# Altium project BRR_CB_P03_REV_A1_1-STM32MP157.PrjPcb (part 1 of 3)
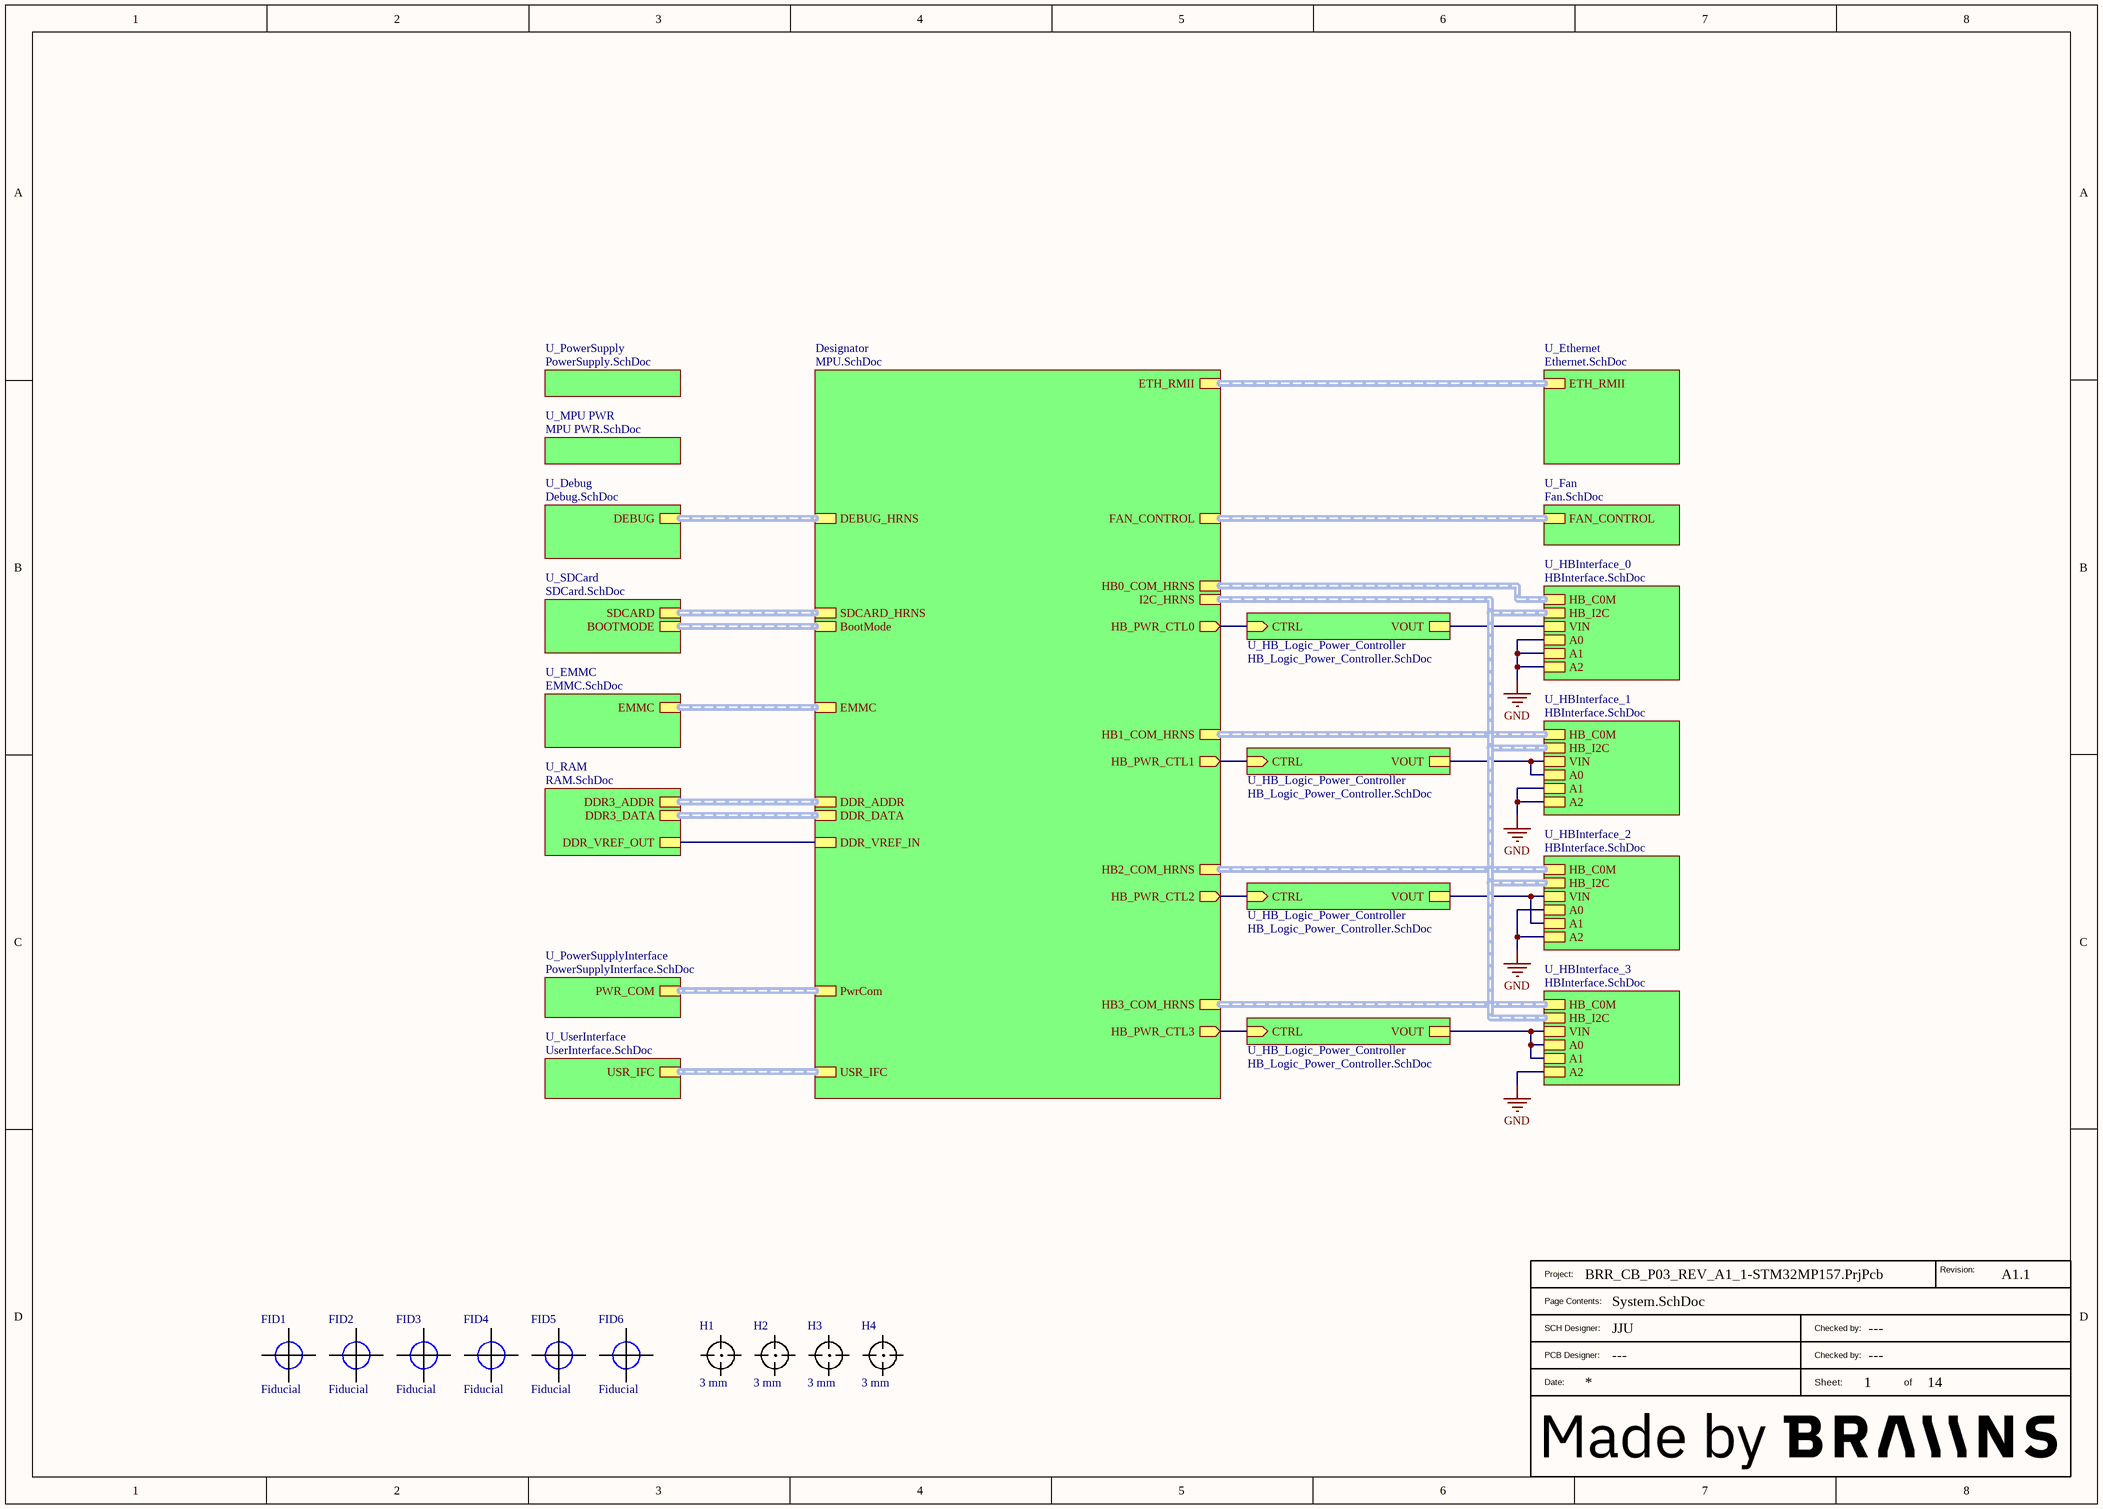
[diagram p0: System.SchDoc]
PcbDesigner: ---; PcbReviewer: ---; Revision: A1.1; SchDesigner: JJU; SchReviewer: ---
14 sheets, 311 parts. Net scope: hierarchical (ports join the sheet entries above them; power ports are global).
Board file: BRR_CB_P03_REV_A1_1-STM32MP157.PcbDoc
Sheets:
  System.SchDoc
    Designator = MPU.SchDoc
    U_Ethernet = Ethernet.SchDoc
    U_Fan = Fan.SchDoc
    U_PowerSupply = PowerSupply.SchDoc
    U_SDCard = SDCard.SchDoc
    U_EMMC = EMMC.SchDoc
    U_RAM = RAM.SchDoc
    U_HBInterface_0 = HBInterface.SchDoc
    U_HBInterface_1 = HBInterface.SchDoc
    U_HBInterface_2 = HBInterface.SchDoc
    U_HBInterface_3 = HBInterface.SchDoc
    U_Debug = Debug.SchDoc
    U_UserInterface = UserInterface.SchDoc
    U_PowerSupplyInterface = PowerSupplyInterface.SchDoc
    U_MPU PWR = MPU PWR.SchDoc
    U_HB_Logic_Power_Controller = HB_Logic_Power_Controller.SchDoc
    U_HB_Logic_Power_Controller = HB_Logic_Power_Controller.SchDoc
    U_HB_Logic_Power_Controller = HB_Logic_Power_Controller.SchDoc
    U_HB_Logic_Power_Controller = HB_Logic_Power_Controller.SchDoc

## Sheet System.SchDoc
size A3; SheetNumber: 1; SheetTotal: 14

### Parts
(Parts that share a designator on the sheet are numbered #1, #2 ... from top to bottom, then left to right.)
?#1  BraiinsTitleBlockWithLogo  (value not drawn)  (graphical)
FID1  Fiducial  [FID_1MM]
FID2  Fiducial  [FID_1MM]
FID3  Fiducial  [FID_1MM]
FID4  Fiducial  [FID_1MM]
FID5  Fiducial  [FID_1MM]
FID6  Fiducial  [FID_1MM]
H1  3 mm  [THT_HOLE_NONPLATE_3_0]
H2  3 mm  [THT_HOLE_NONPLATE_3_0]
H3  3 mm  [THT_HOLE_NONPLATE_3_0]
H4  3 mm  [THT_HOLE_NONPLATE_3_0]

### Sub-sheets
Designator = MPU.SchDoc: DDR_ADDR (harness DDR_ADDR), DEBUG_HRNS (harness DEBUG_HRNS), DDR_DATA (harness DDR_DATA), DDR_VREF_IN, SDCARD_HRNS (harness SDCARD_HRNS), EMMC (harness EMMC), ETH_RMII (harness ETH_RMII), HB2_COM_HRNS (harness HB_COM_HRNS), HB3_COM_HRNS (harness HB_COM_HRNS), HB0_COM_HRNS (harness HB_COM_HRNS), HB1_COM_HRNS (harness HB_COM_HRNS), PwrCom (harness PwrCom), I2C_HRNS (harness I2C_HRNS), FAN_CONTROL (harness FAN_CONTROL), BootMode (harness BootMode), USR_IFC (harness USR_IFC), HB_PWR_CTL2 (out), HB_PWR_CTL1 (out), HB_PWR_CTL3 (out), HB_PWR_CTL0 (out)
U_Debug = Debug.SchDoc: DEBUG (harness DEBUG_HRNS)
U_EMMC = EMMC.SchDoc: EMMC (harness EMMC)
U_Ethernet = Ethernet.SchDoc: ETH_RMII (harness ETH_RMII)
U_Fan = Fan.SchDoc: FAN_CONTROL (harness FAN_CONTROL)
U_HB_Logic_Power_Controller = HB_Logic_Power_Controller.SchDoc: VOUT, CTRL (in)
U_HB_Logic_Power_Controller = HB_Logic_Power_Controller.SchDoc: VOUT, CTRL (in)
U_HB_Logic_Power_Controller = HB_Logic_Power_Controller.SchDoc: VOUT, CTRL (in)
U_HB_Logic_Power_Controller = HB_Logic_Power_Controller.SchDoc: VOUT, CTRL (in)
U_HBInterface_0 = HBInterface.SchDoc: HB_C0M (harness HB_COM_HRNS), HB_I2C (harness I2C_HRNS), A0, A1, A2, VIN
U_HBInterface_1 = HBInterface.SchDoc: HB_C0M (harness HB_COM_HRNS), HB_I2C (harness I2C_HRNS), A0, A1, A2, VIN
U_HBInterface_2 = HBInterface.SchDoc: HB_C0M (harness HB_COM_HRNS), HB_I2C (harness I2C_HRNS), A0, A1, A2, VIN
U_HBInterface_3 = HBInterface.SchDoc: HB_C0M (harness HB_COM_HRNS), HB_I2C (harness I2C_HRNS), A0, A1, A2, VIN
U_MPU PWR = MPU PWR.SchDoc: no entries
U_PowerSupply = PowerSupply.SchDoc: no entries
U_PowerSupplyInterface = PowerSupplyInterface.SchDoc: PWR_COM (harness PwrCom)
U_RAM = RAM.SchDoc: DDR3_ADDR (harness DDR_ADDR), DDR3_DATA (harness DDR_DATA), DDR_VREF_OUT
U_SDCard = SDCard.SchDoc: SDCARD (harness SDCARD_HRNS), BOOTMODE (harness BootMode)
U_UserInterface = UserInterface.SchDoc: USR_IFC (harness USR_IFC)

### Nets
DDR_VREF: sheet Designator/DDR_VREF_IN, sheet U_RAM/DDR_VREF_OUT
GND: sheet U_HBInterface_0/A0, sheet U_HBInterface_0/A1, sheet U_HBInterface_0/A2, sheet U_HBInterface_1/A1, sheet U_HBInterface_1/A2, sheet U_HBInterface_2/A0, sheet U_HBInterface_2/A2, sheet U_HBInterface_3/A2
3V3_PROTECTED: sheet U_HBInterface_0/VIN, sheet U_HB_Logic_Power_Controller/VOUT
3V3_PROTECTED: sheet U_HBInterface_1/A0, sheet U_HBInterface_1/VIN, sheet U_HB_Logic_Power_Controller/VOUT  [a separate net that carries the same name]
3V3_PROTECTED: sheet U_HBInterface_2/A1, sheet U_HBInterface_2/VIN, sheet U_HB_Logic_Power_Controller/VOUT  [a separate net that carries the same name]
3V3_PROTECTED: sheet U_HBInterface_3/A0, sheet U_HBInterface_3/A1, sheet U_HBInterface_3/VIN, sheet U_HB_Logic_Power_Controller/VOUT  [a separate net that carries the same name]
HB_PWR_CTL0: sheet Designator/HB_PWR_CTL0, sheet U_HB_Logic_Power_Controller/CTRL
HB_PWR_CTL1: sheet Designator/HB_PWR_CTL1, sheet U_HB_Logic_Power_Controller/CTRL
HB_PWR_CTL2: sheet Designator/HB_PWR_CTL2, sheet U_HB_Logic_Power_Controller/CTRL
HB_PWR_CTL3: sheet Designator/HB_PWR_CTL3, sheet U_HB_Logic_Power_Controller/CTRL

### Buses and harness runs
harness sheet Designator/BootMode = sheet U_SDCard/BOOTMODE
harness sheet Designator/DDR_ADDR = sheet U_RAM/DDR3_ADDR
harness sheet Designator/DDR_DATA = sheet U_RAM/DDR3_DATA
harness sheet Designator/DEBUG_HRNS = sheet U_Debug/DEBUG
harness sheet Designator/EMMC = sheet U_EMMC/EMMC
harness sheet Designator/ETH_RMII = sheet U_Ethernet/ETH_RMII
harness sheet Designator/FAN_CONTROL = sheet U_Fan/FAN_CONTROL
harness sheet Designator/HB0_COM_HRNS = sheet U_HBInterface_0/HB_C0M
harness sheet Designator/HB1_COM_HRNS = sheet U_HBInterface_1/HB_C0M
harness sheet Designator/HB2_COM_HRNS = sheet U_HBInterface_2/HB_C0M
harness sheet Designator/HB3_COM_HRNS = sheet U_HBInterface_3/HB_C0M
harness sheet Designator/I2C_HRNS = sheet U_HBInterface_0/HB_I2C = sheet U_HBInterface_1/HB_I2C = sheet U_HBInterface_2/HB_I2C = sheet U_HBInterface_3/HB_I2C
harness sheet Designator/PwrCom = sheet U_PowerSupplyInterface/PWR_COM
harness sheet Designator/SDCARD_HRNS = sheet U_SDCard/SDCARD
harness sheet Designator/USR_IFC = sheet U_UserInterface/USR_IFC

### Notes on the sheet
- (in symbol BraiinsTitleBlockWithLogo) Revision:; Project:; Page Contents:; SCH Designer:; Checked by:; PCB Designer:; Date:; Sheet:; of

### Library data of the parts
FID1-FID6 = 30186: Fiducial 1mm; Part_Type: Other; Part_Status: New; ID: 30186; Updated By: janjuranek; Manufacturer Part Description: Fiducial 1mm; Created By: janjuranek; Created_Date: 2023-05-23 18:24:59; Updated_Date: 2023-05-23 18:25:39; ComponentLink1Description: Datasheet; ComponentLink2Description: Supplier Part Details
H1-H4 = 30117: Mechanical hole, non plated; Part_Status: New; ID: 30117; Updated By: janjuranek; Value: 3 mm; Part_Type: Mechanical; Manufacturer Part Description: Mechanical hole, non plated; Created By: janjuranek; Created_Date: 2023-03-17 21:20:29; Updated_Date: 2023-03-17 21:20:49; ComponentLink1Description: Datasheet; ComponentLink2Description: Supplier Part Details

## Sheet MPU.SchDoc
size A3; SheetNumber: 8; SheetTotal: 14
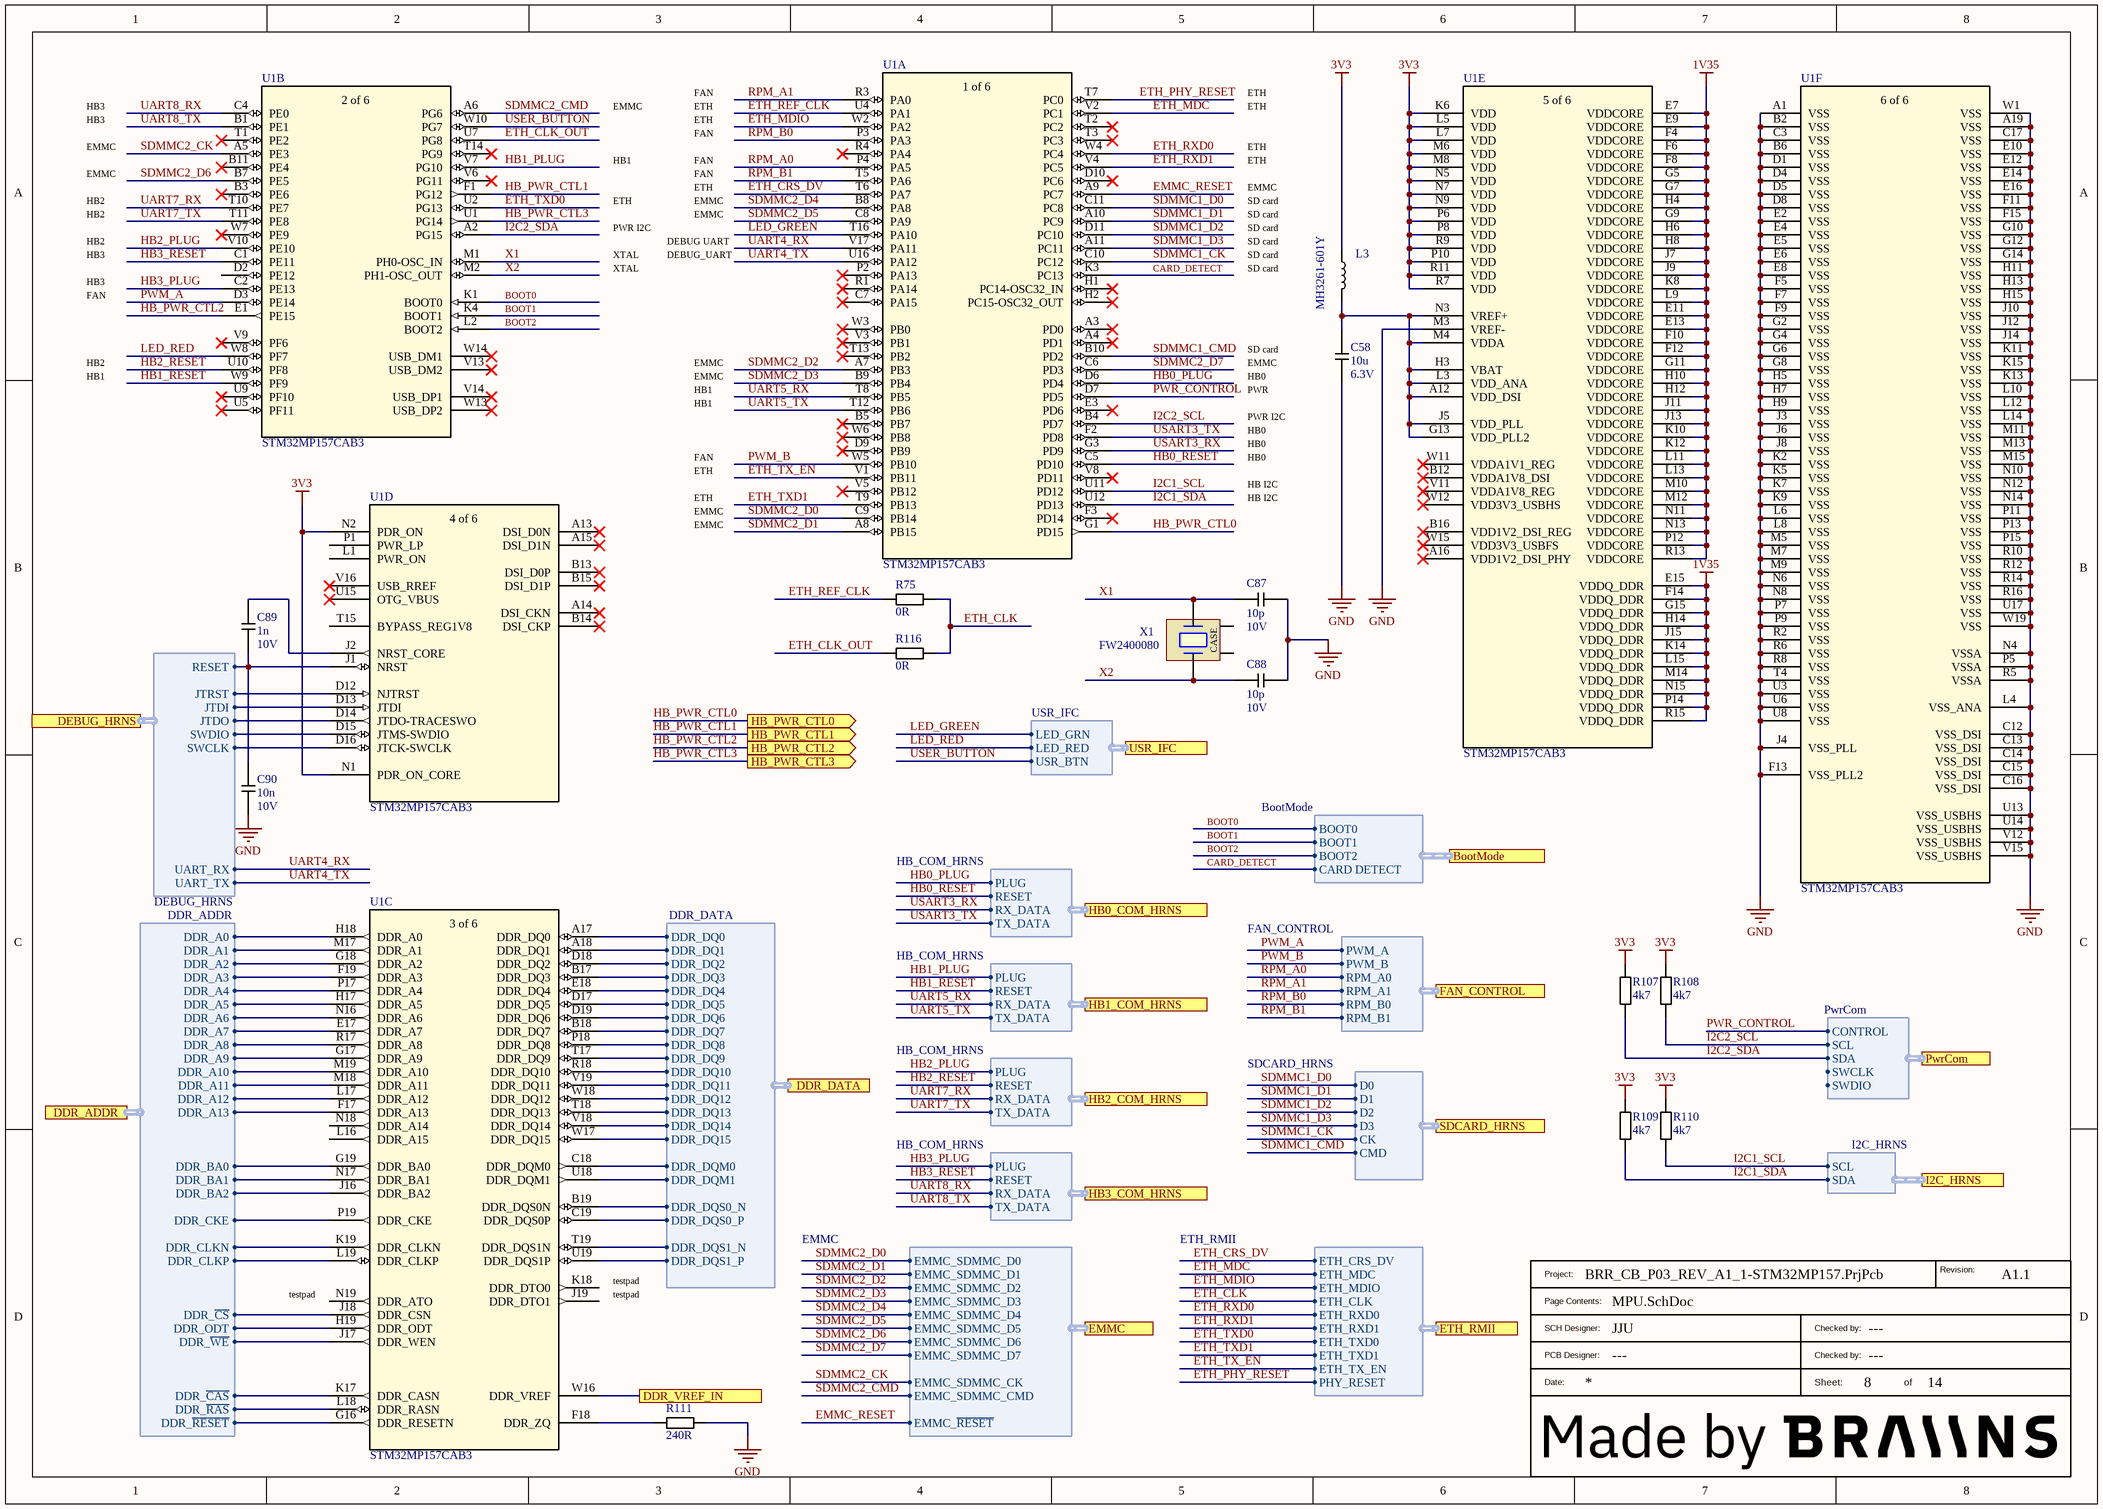
[diagram p1: MPU.SchDoc]

### Parts
(Parts that share a designator on the sheet are numbered #1, #2 ... from top to bottom, then left to right.)
?#2  BraiinsTitleBlockWithLogo  (value not drawn)  (graphical)
C58  Voltage_Rating: 6.3V  [CAP0603]  (hidden comment: 10u)
C87  Voltage_Rating: 10V  [CAP0402]  (hidden comment: 10p)
C88  Voltage_Rating: 10V  [CAP0402]  (hidden comment: 10p)
C89  Voltage_Rating: 10V  [CAP0402]  (hidden comment: 1n)
C90  Voltage_Rating: 10V  [CAP0402]  (hidden comment: 10n)
L3  MH3261-601Y  [RES1206]
R75  0R  [RES0402]
R107  4k7  [RES0402]
R108  4k7  [RES0402]
R109  4k7  [RES0402]
R110  4k7  [RES0402]
R111  240R  [RES0402]
R116  0R  [RES0402]
U1  STM32MP157CAB3  [LFBGA354_16X16]  (parts A,B,C,D,E,F of 6)
X1  FW2400080  [XTAL_4PIN_20X16]

### Ports
BootMode (harness BootMode), DDR_ADDR (harness DDR_ADDR), DDR_DATA (harness DDR_DATA), DDR_VREF_IN, DEBUG_HRNS (harness DEBUG_HRNS), EMMC (harness EMMC), ETH_RMII (harness ETH_RMII), FAN_CONTROL (harness FAN_CONTROL), HB0_COM_HRNS (harness HB_COM_HRNS), HB1_COM_HRNS (harness HB_COM_HRNS), HB2_COM_HRNS (harness HB_COM_HRNS), HB3_COM_HRNS (harness HB_COM_HRNS), HB_PWR_CTL0 (out), HB_PWR_CTL1 (out), HB_PWR_CTL2 (out), HB_PWR_CTL3 (out), I2C_HRNS (harness I2C_HRNS), PwrCom (harness PwrCom), SDCARD_HRNS (harness SDCARD_HRNS), USR_IFC (harness USR_IFC)

### Harnesses
DDR_DATA: DDR_DQ0, DDR_DQ1, DDR_DQ10, DDR_DQ11, DDR_DQ12, DDR_DQ13, DDR_DQ14, DDR_DQ15, DDR_DQ2, DDR_DQ3, DDR_DQ4, DDR_DQ5, DDR_DQ6, DDR_DQ7, DDR_DQ8, DDR_DQ9, DDR_DQM0, DDR_DQM1, DDR_DQS0_N, DDR_DQS0_P, DDR_DQS1_N, DDR_DQS1_P
DDR_ADDR: DDR_A0, DDR_A1, DDR_A10, DDR_A11, DDR_A12, DDR_A13, DDR_A2, DDR_A3, DDR_A4, DDR_A5, DDR_A6, DDR_A7, DDR_A8, DDR_A9, DDR_BA0, DDR_BA1, DDR_BA2, DDR_CKE, DDR_CLKN, DDR_CLKP, DDR_~{CAS}, DDR_~{CS}, DDR_ODT, DDR_~{RAS}, DDR_~{RESET}, DDR_~{WE}
DEBUG_HRNS: JTDI, JTDO, JTRST, RESET, SWCLK, SWDIO, UART_TX, UART_RX
SDCARD_HRNS: CK, CMD, D0, D1, D2, D3
EMMC: EMMC_~{RESET}, EMMC_SDMMC_CK, EMMC_SDMMC_CMD, EMMC_SDMMC_D0, EMMC_SDMMC_D1, EMMC_SDMMC_D2, EMMC_SDMMC_D3, EMMC_SDMMC_D4, EMMC_SDMMC_D5, EMMC_SDMMC_D6, EMMC_SDMMC_D7
ETH_RMII: ETH_CRS_DV, ETH_MDC, ETH_MDIO, ETH_CLK, ETH_RXD0, ETH_RXD1, ETH_TXD0, ETH_TXD1, ETH_TX_EN, PHY_RESET
HB_COM_HRNS: PLUG, RESET, RX_DATA, TX_DATA
I2C_HRNS: SCL, SDA
PwrCom: CONTROL, SCL, SDA, SWCLK, SWDIO
FAN_CONTROL: PWM_A, PWM_B, RPM_A0, RPM_A1, RPM_B0, RPM_B1
BootMode: BOOT0, BOOT1, BOOT2, CARD DETECT
USR_IFC: LED_GRN, LED_RED, USR_BTN

### Nets
1V35: U1.E7(VDDCORE) U1.E9(VDDCORE) U1.E11(VDDCORE) U1.E13(VDDCORE) U1.E15(VDDQ_DDR) U1.F4(VDDCORE) U1.F6(VDDCORE) U1.F8(VDDCORE) U1.F10(VDDCORE) U1.F12(VDDCORE) U1.F14(VDDQ_DDR) U1.G5(VDDCORE) U1.G7(VDDCORE) U1.G9(VDDCORE) U1.G11(VDDCORE) U1.G15(VDDQ_DDR) U1.H4(VDDCORE) U1.H6(VDDCORE) U1.H8(VDDCORE) U1.H10(VDDCORE) U1.H12(VDDCORE) U1.H14(VDDQ_DDR) U1.J7(VDDCORE) U1.J9(VDDCORE) U1.J11(VDDCORE) U1.J13(VDDCORE) U1.J15(VDDQ_DDR) U1.K8(VDDCORE) U1.K10(VDDCORE) U1.K12(VDDCORE) U1.K14(VDDQ_DDR) U1.L9(VDDCORE) U1.L11(VDDCORE) U1.L13(VDDCORE) U1.L15(VDDQ_DDR) U1.M10(VDDCORE) U1.M12(VDDCORE) U1.M14(VDDQ_DDR) U1.N11(VDDCORE) U1.N13(VDDCORE) U1.N15(VDDQ_DDR) U1.P12(VDDCORE) U1.P14(VDDQ_DDR) U1.R13(VDDCORE) U1.R15(VDDQ_DDR)
3V3: L3.1 R107.1 R108.1 R109.1 R110.1 U1.K6(VDD) U1.L5(VDD) U1.L7(VDD) U1.M6(VDD) U1.M8(VDD) U1.N1(PDR_ON_CORE) U1.N2(PDR_ON) U1.N5(VDD) U1.N7(VDD) U1.N9(VDD) U1.P6(VDD) U1.P8(VDD) U1.P10(VDD) U1.R7(VDD) U1.R9(VDD) U1.R11(VDD)
DDR_VREF: U1.W16(DDR_VREF) ; port DDR_VREF_IN
GND: C58.2 C87.1 C88.2 C90.2 R111.2 U1.A1(VSS) U1.A19(VSS) U1.B2(VSS) U1.B6(VSS) U1.C3(VSS) U1.C12(VSS_DSI) U1.C13(VSS_DSI) U1.C14(VSS_DSI) U1.C15(VSS_DSI) U1.C16(VSS_DSI) U1.C17(VSS) U1.D1(VSS) U1.D4(VSS) U1.D5(VSS) U1.D8(VSS) U1.E2(VSS) U1.E4(VSS) U1.E5(VSS) U1.E6(VSS) U1.E8(VSS) U1.E10(VSS) U1.E12(VSS) U1.E14(VSS) U1.E16(VSS) U1.F5(VSS) U1.F7(VSS) U1.F9(VSS) U1.F11(VSS) U1.F13(VSS_PLL2) U1.F15(VSS) U1.G2(VSS) U1.G4(VSS) U1.G6(VSS) U1.G8(VSS) U1.G10(VSS) U1.G12(VSS) U1.G14(VSS) U1.H5(VSS) U1.H7(VSS) U1.H9(VSS) U1.H11(VSS) U1.H13(VSS) U1.H15(VSS) U1.J3(VSS) U1.J4(VSS_PLL) U1.J6(VSS) U1.J8(VSS) U1.J10(VSS) U1.J12(VSS) U1.J14(VSS) U1.K2(VSS) U1.K5(VSS) U1.K7(VSS) U1.K9(VSS) U1.K11(VSS) U1.K13(VSS) U1.K15(VSS) U1.L4(VSS_ANA) U1.L6(VSS) U1.L8(VSS) U1.L10(VSS) U1.L12(VSS) U1.L14(VSS) U1.M3(VREF-) U1.M5(VSS) U1.M7(VSS) U1.M9(VSS) U1.M11(VSS) U1.M13(VSS) U1.M15(VSS) U1.N4(VSSA) U1.N6(VSS) U1.N8(VSS) U1.N10(VSS) U1.N12(VSS) U1.N14(VSS) U1.P5(VSSA) U1.P7(VSS) U1.P9(VSS) U1.P11(VSS) U1.P13(VSS) U1.P15(VSS) U1.R2(VSS) U1.R5(VSSA) U1.R6(VSS) U1.R8(VSS) U1.R10(VSS) U1.R12(VSS) U1.R14(VSS) U1.R16(VSS) U1.T4(VSS) U1.U3(VSS) U1.U6(VSS) U1.U8(VSS) U1.U13(VSS_USBHS) U1.U14(VSS_USBHS) U1.U17(VSS) U1.V12(VSS_USBHS) U1.V15(VSS_USBHS) U1.W1(VSS) U1.W19(VSS)
BOOT0: U1.K1(BOOT0) ; port BootMode.BOOT0
BOOT1: U1.K4(BOOT1) ; port BootMode.BOOT1
BOOT2: U1.L2(BOOT2) ; port BootMode.BOOT2
CARD_DETECT: U1.K3(PC13) ; port BootMode.CARD DETECT
DDR3_A0: U1.H18(DDR_A0) ; port DDR_ADDR.DDR_A0
DDR3_A1: U1.M17(DDR_A1) ; port DDR_ADDR.DDR_A1
DDR3_A2: U1.G18(DDR_A2) ; port DDR_ADDR.DDR_A2
DDR3_A3: U1.F19(DDR_A3) ; port DDR_ADDR.DDR_A3
DDR3_A4: U1.P17(DDR_A4) ; port DDR_ADDR.DDR_A4
DDR3_A5: U1.H17(DDR_A5) ; port DDR_ADDR.DDR_A5
DDR3_A6: U1.N16(DDR_A6) ; port DDR_ADDR.DDR_A6
DDR3_A7: U1.E17(DDR_A7) ; port DDR_ADDR.DDR_A7
DDR3_A8: U1.R17(DDR_A8) ; port DDR_ADDR.DDR_A8
DDR3_A9: U1.G17(DDR_A9) ; port DDR_ADDR.DDR_A9
DDR3_A10: U1.M19(DDR_A10) ; port DDR_ADDR.DDR_A10
DDR3_A11: U1.M18(DDR_A11) ; port DDR_ADDR.DDR_A11
DDR3_A12: U1.L17(DDR_A12) ; port DDR_ADDR.DDR_A12
DDR3_A13: U1.F17(DDR_A13) ; port DDR_ADDR.DDR_A13
DDR3_BA0: U1.G19(DDR_BA0) ; port DDR_ADDR.DDR_BA0
DDR3_BA1: U1.N17(DDR_BA1) ; port DDR_ADDR.DDR_BA1
DDR3_BA2: U1.J16(DDR_BA2) ; port DDR_ADDR.DDR_BA2
DDR3_CASN: U1.K17(DDR_CASN) ; port DDR_ADDR.DDR_~{CAS}
DDR3_CKE: U1.P19(DDR_CKE) ; port DDR_ADDR.DDR_CKE
DDR3_CLK_N: U1.K19(DDR_CLKN) ; port DDR_ADDR.DDR_CLKN
DDR3_CLK_P: U1.L19(DDR_CLKP) ; port DDR_ADDR.DDR_CLKP
DDR3_CSN: U1.J18(DDR_CSN) ; port DDR_ADDR.DDR_~{CS}
DDR3_DQ0: U1.A17(DDR_DQ0) ; port DDR_DATA.DDR_DQ0
DDR3_DQ1: U1.A18(DDR_DQ1) ; port DDR_DATA.DDR_DQ1
DDR3_DQ2: U1.D18(DDR_DQ2) ; port DDR_DATA.DDR_DQ2
DDR3_DQ3: U1.B17(DDR_DQ3) ; port DDR_DATA.DDR_DQ3
DDR3_DQ4: U1.E18(DDR_DQ4) ; port DDR_DATA.DDR_DQ4
DDR3_DQ5: U1.D17(DDR_DQ5) ; port DDR_DATA.DDR_DQ5
DDR3_DQ6: U1.D19(DDR_DQ6) ; port DDR_DATA.DDR_DQ6
DDR3_DQ7: U1.B18(DDR_DQ7) ; port DDR_DATA.DDR_DQ7
DDR3_DQ8: U1.P18(DDR_DQ8) ; port DDR_DATA.DDR_DQ8
DDR3_DQ9: U1.T17(DDR_DQ9) ; port DDR_DATA.DDR_DQ9
DDR3_DQ10: U1.R18(DDR_DQ10) ; port DDR_DATA.DDR_DQ10
DDR3_DQ11: U1.V19(DDR_DQ11) ; port DDR_DATA.DDR_DQ11
DDR3_DQ12: U1.W18(DDR_DQ12) ; port DDR_DATA.DDR_DQ12
DDR3_DQ13: U1.T18(DDR_DQ13) ; port DDR_DATA.DDR_DQ13
DDR3_DQ14: U1.V18(DDR_DQ14) ; port DDR_DATA.DDR_DQ14
DDR3_DQ15: U1.W17(DDR_DQ15) ; port DDR_DATA.DDR_DQ15
DDR3_DQM0: U1.C18(DDR_DQM0) ; port DDR_DATA.DDR_DQM0
DDR3_DQM1: U1.U18(DDR_DQM1) ; port DDR_DATA.DDR_DQM1
DDR3_DQS0_N: U1.C19(DDR_DQS0P) ; port DDR_DATA.DDR_DQS0_P
DDR3_DQS0_P: U1.B19(DDR_DQS0N) ; port DDR_DATA.DDR_DQS0_N
DDR3_DQS1_N: U1.T19(DDR_DQS1N) ; port DDR_DATA.DDR_DQS1_N
DDR3_DQS1_P: U1.U19(DDR_DQS1P) ; port DDR_DATA.DDR_DQS1_P
DDR3_ODT: U1.H19(DDR_ODT) ; port DDR_ADDR.DDR_ODT
DDR3_RASN: U1.L18(DDR_RASN) ; port DDR_ADDR.DDR_~{RAS}
DDR3_RESETN: U1.G16(DDR_RESETN) ; port DDR_ADDR.DDR_~{RESET}
DDR3_WEN: U1.J17(DDR_WEN) ; port DDR_ADDR.DDR_~{WE}
EMMC_RESET: U1.A9(PC7) ; port EMMC.EMMC_~{RESET}
ETH_CLK: R75.2 R116.2 ; port ETH_RMII.ETH_CLK
ETH_CLK_OUT: R116.1 U1.U7(PG8)
ETH_CRS_DV: U1.T6(PA7) ; port ETH_RMII.ETH_CRS_DV
ETH_MDC: U1.V2(PC1) ; port ETH_RMII.ETH_MDC
ETH_MDIO: U1.W2(PA2) ; port ETH_RMII.ETH_MDIO
ETH_PHY_RESET: U1.T7(PC0) ; port ETH_RMII.PHY_RESET
ETH_REF_CLK: R75.1 U1.U4(PA1)
ETH_RXD0: U1.W4(PC4) ; port ETH_RMII.ETH_RXD0
ETH_RXD1: U1.V4(PC5) ; port ETH_RMII.ETH_RXD1
ETH_TX_EN: U1.V1(PB11) ; port ETH_RMII.ETH_TX_EN
ETH_TXD0: U1.U2(PG13) ; port ETH_RMII.ETH_TXD0
ETH_TXD1: U1.T9(PB13) ; port ETH_RMII.ETH_TXD1
HB0_PLUG: U1.D6(PD4) ; port HB0_COM_HRNS.PLUG
HB0_RESET: U1.C5(PD10) ; port HB0_COM_HRNS.RESET
HB1_PLUG: U1.V7(PG10) ; port HB1_COM_HRNS.PLUG
HB1_RESET: U1.W9(PF9) ; port HB1_COM_HRNS.RESET
HB2_PLUG: U1.V10(PE10) ; port HB2_COM_HRNS.PLUG
HB2_RESET: U1.U10(PF8) ; port HB2_COM_HRNS.RESET
HB3_PLUG: U1.C2(PE13) ; port HB3_COM_HRNS.PLUG
HB3_RESET: U1.C1(PE11) ; port HB3_COM_HRNS.RESET
HB_PWR_CTL0: U1.G1(PD15) ; port HB_PWR_CTL0
HB_PWR_CTL1: U1.F1(PG12) ; port HB_PWR_CTL1
HB_PWR_CTL2: U1.E1(PE15) ; port HB_PWR_CTL2
HB_PWR_CTL3: U1.U1(PG14) ; port HB_PWR_CTL3
I2C1_SCL: R110.2 U1.U11(PD12) ; port I2C_HRNS.SCL
I2C1_SDA: R109.2 U1.U12(PD13) ; port I2C_HRNS.SDA
I2C2_SCL: R108.2 U1.B4(PD7) ; port PwrCom.SCL
I2C2_SDA: R107.2 U1.A2(PG15) ; port PwrCom.SDA
LED_GREEN: U1.T16(PA10) ; port USR_IFC.LED_GRN  [project net LED_G]
LED_RED: U1.W8(PF7) ; port USR_IFC.LED_RED  [project net LED_R]
PWM_A: U1.D3(PE14) ; port FAN_CONTROL.PWM_A
PWM_B: U1.W5(PB10) ; port FAN_CONTROL.PWM_B
PWR_CONTROL: U1.D7(PD5) ; port PwrCom.CONTROL
RPM_A0: U1.P4(PA5) ; port FAN_CONTROL.RPM_A0
RPM_A1: U1.R3(PA0) ; port FAN_CONTROL.RPM_A1
RPM_B0: U1.P3(PA3) ; port FAN_CONTROL.RPM_B0
RPM_B1: U1.T5(PA6) ; port FAN_CONTROL.RPM_B1
SDMMC1_CK: U1.C10(PC12) ; port SDCARD_HRNS.CK
SDMMC1_CMD: U1.B10(PD2) ; port SDCARD_HRNS.CMD
SDMMC1_D0: U1.C11(PC8) ; port SDCARD_HRNS.D0
SDMMC1_D1: U1.A10(PC9) ; port SDCARD_HRNS.D1
SDMMC1_D2: U1.D11(PC10) ; port SDCARD_HRNS.D2
SDMMC1_D3: U1.A11(PC11) ; port SDCARD_HRNS.D3
SDMMC2_CK: U1.A5(PE3) ; port EMMC.EMMC_SDMMC_CK
SDMMC2_CMD: U1.A6(PG6) ; port EMMC.EMMC_SDMMC_CMD
SDMMC2_D0: U1.C9(PB14) ; port EMMC.EMMC_SDMMC_D0
SDMMC2_D1: U1.A8(PB15) ; port EMMC.EMMC_SDMMC_D1
SDMMC2_D2: U1.A7(PB3) ; port EMMC.EMMC_SDMMC_D2
SDMMC2_D3: U1.B9(PB4) ; port EMMC.EMMC_SDMMC_D3
SDMMC2_D4: U1.B8(PA8) ; port EMMC.EMMC_SDMMC_D4
SDMMC2_D5: U1.C8(PA9) ; port EMMC.EMMC_SDMMC_D5
SDMMC2_D6: U1.B7(PE5) ; port EMMC.EMMC_SDMMC_D6
SDMMC2_D7: U1.C6(PD3) ; port EMMC.EMMC_SDMMC_D7
UART4_RX: U1.V17(PA11) ; port DEBUG_HRNS.UART_RX
UART4_TX: U1.U16(PA12) ; port DEBUG_HRNS.UART_TX
UART5_RX: U1.T8(PB5) ; port HB1_COM_HRNS.RX_DATA  [project net HB_RXD]
UART5_TX: U1.T12(PB6) ; port HB1_COM_HRNS.TX_DATA  [project net HB_TXD]
UART7_RX: U1.T10(PE7) ; port HB2_COM_HRNS.RX_DATA  [project net HB_RXD]
UART7_TX: U1.T11(PE8) ; port HB2_COM_HRNS.TX_DATA  [project net HB_TXD]
UART8_RX: U1.C4(PE0) ; port HB3_COM_HRNS.RX_DATA  [project net HB_RXD]
UART8_TX: U1.B1(PE1) ; port HB3_COM_HRNS.TX_DATA  [project net HB_TXD]
USART3_RX: U1.G3(PD9) ; port HB0_COM_HRNS.RX_DATA  [project net HB_RXD]
USART3_TX: U1.F2(PD8) ; port HB0_COM_HRNS.TX_DATA  [project net HB_TXD]
USER_BUTTON: U1.W10(PG7) ; port USR_IFC.USR_BTN
X1: C87.2 U1.M1(PH0-OSC_IN) X1.3(X2)
X2: C88.1 U1.M2(PH1-OSC_OUT) X1.1(X1)
NetC58_1: C58.1 L3.2 U1.A12(VDD_DSI) U1.G13(VDD_PLL2) U1.H3(VBAT) U1.J5(VDD_PLL) U1.L3(VDD_ANA) U1.M4(VDDA) U1.N3(VREF+)
NetC89_1: C89.1 U1.J2(NRST_CORE)
NetC89_2: C89.2 C90.1 U1.J1(NRST) ; port DEBUG_HRNS.RESET
NetCON11_3: U1.D14(JTDO-TRACESWO) ; port DEBUG_HRNS.JTDO
NetCON11_4: U1.D16(JTCK-SWCLK) ; port DEBUG_HRNS.SWCLK
NetCON11_5: U1.D15(JTMS-SWDIO) ; port DEBUG_HRNS.SWDIO
NetCON11_6: U1.D13(JTDI) ; port DEBUG_HRNS.JTDI
NetCON11_7: U1.D12(NJTRST) ; port DEBUG_HRNS.JTRST
NetR111_1: R111.1 U1.F18(DDR_ZQ)

Not connected (* = marked no-connect by the designer): U1 A3(PD0)* A4(PD1)* A13(DSI_D0N)* A14(DSI_CKN)* A15(DSI_D1N)* A16(VDD1V2_DSI_PHY)* B3(PE6)* B5(PB7)* B11(PE4)* B12(VDDA1V8_DSI)* B13(DSI_D0P)* B14(DSI_CKP)* B15(DSI_D1P)* B16(VDD1V2_DSI_REG)* C7(PA15)* D2(PE12) D9(PB9)* D10(PC6)* E3(PD6)* F3(PD14)* H1(PC14-OSC32_IN)* H2(PC15-OSC32_OUT)* J19(DDR_DTO1) K18(DDR_DTO0) L1(PWR_ON) L16(DDR_A15) N18(DDR_A14) N19(DDR_ATO) P1(PWR_LP) P2(PA13)* R1(PA14)* R4(PA4)* T1(PE2)* T2(PC2)* T3(PC3)* T13(PB2)* T14(PG9)* T15(BYPASS_REG1V8) U5(PF11)* U9(PF10)* U15(OTG_VBUS)* V3(PB1)* V5(PB12)* V6(PG11)* V8(PD11)* V9(PF6)* V11(VDDA1V8_REG)* V13(USB_DM2)* V14(USB_DP1)* V16(USB_RREF)* W3(PB0)* W6(PB8)* W7(PE9)* W11(VDDA1V1_REG)* W12(VDD3V3_USBHS)* W13(USB_DP2)* W14(USB_DM1)* W15(VDD3V3_USBFS)*; X1 2(CASE) 4(CASE)

### Notes on the sheet
- HB3
- EMMC
- ETH
- FAN
- HB1
- HB2
- PWR I2C
- DEBUG UART
- SD card
- XTAL
- DEBUG_UART
- HB0
- PWR
- HB I2C
- (near U1) testpad
- testpad
- (in symbol 30145, part A) 1 of 6
- (in symbol 30145, part B) 2 of 6
- (in symbol 30145, part C) 3 of 6
- (in symbol 30145, part D) 4 of 6
- (in symbol 30145, part E) 5 of 6
- (in symbol 30145, part F) 6 of 6
- (in symbol BraiinsTitleBlockWithLogo) Revision:; Project:; Page Contents:; SCH Designer:; Checked by:; PCB Designer:; Date:; Sheet:; of

### Library data of the parts
C58 = 30139: CAP CER 10u 10% 6.3V 0603 X5R; Part_Type: Capacitor; Part_Status: New; ID: 30139; Updated By: janjuranek; Sorted_Value: 10; Value: 10u; Sub_Type: CER; Manufacturer Part Description: CAP CER 10u 10% 6.3V 0603 X5R; Package_Case: 0603; RoHS: Yes; Dielectric: X5R; Tolerance: 10%; Created By: janjuranek; Created_Date: 2023-04-12 21:40:22; Updated_Date: 2023-04-12 21:42:06; ComponentLink1Description: Datasheet; ComponentLink2Description: Supplier Part Details
C87 C88 = 30167: CAP CER 10p 10% 10V X7R 0402; Part_Type: Capacitor; Part_Status: New; ID: 30167; Updated By: janjuranek; Sorted_Value: 10; Value: 10p; Sub_Type: CER; Manufacturer Part Description: CAP CER 10p 10% 10V X7R 0402; Package_Case: 0402; RoHS: Yes; Dielectric: X7R; Tolerance: 10%; Created By: janjuranek; Created_Date: 2023-05-01 22:54:33; Updated_Date: 2023-05-01 22:55:10; ComponentLink1Description: Datasheet; ComponentLink2Description: Supplier Part Details
C89 = 30168: CAP CER 1n 10% 10V X7R 0402; Part_Type: Capacitor; Part_Status: New; ID: 30168; Updated By: janjuranek; Sorted_Value: 1; Value: 1n; Sub_Type: CER; Manufacturer Part Description: CAP CER 1n 10% 10V X7R 0402; Package_Case: 0402; RoHS: Yes; Dielectric: X7R; Tolerance: 10%; Created By: janjuranek; Created_Date: 2023-05-02 09:44:44; Updated_Date: 2023-05-02 09:45:52; ComponentLink1Description: Datasheet; ComponentLink2Description: Supplier Part Details
C90 = 30169: CAP CER 10n 10% 10V X7R 0402; Part_Type: Capacitor; Part_Status: New; ID: 30169; Updated By: janjuranek; Sorted_Value: 10; Value: 10n; Sub_Type: CER; Manufacturer Part Description: CAP CER 10n 10% 10V X7R 0402; Package_Case: 0402; RoHS: Yes; Dielectric: X7R; Tolerance: 10%; Created By: janjuranek; Created_Date: 2023-05-02 09:45:11; Updated_Date: 2023-05-02 09:47:54; ComponentLink1Description: Datasheet; ComponentLink2Description: Supplier Part Details
L3 = 30184: FERRITE BEAD 600 OHM 1206 1LN; Part_Type: Filter; Manufacturer: Bourns Inc.; Part_Status: New; ID: 30184; Current_Rating: 2A; Updated By: janjuranek; Value: MH3261-601Y; Manufacturer Part Number: MH3261-601Y; Manufacturer Part Description: FERRITE BEAD 600 OHM 1206 1LN; Supplier 1: Digi-Key; Supplier Part Number 1: MH3261-601YTR-ND; Package_Case: 1206; RoHS: Yes; Temperature Range: -55C to +125C; Created By: janjuranek; Created_Date: 2023-05-23 03:45:05; Updated_Date: 2023-05-23 03:45:38; ComponentLink1Description: Datasheet; ComponentLink2Description: Supplier Part Details; ComponentLink2URL: https://www.digikey.com/products/en?keywords=MH3261-601Y
R75 R116 = 30178: RES 0R Ohm 1% 0402; Part_Status: New; ID: 30178; Updated By: janjuranek; Sorted_Value: 0; Value: 0R; Part_Type: Resistor; Manufacturer Part Description: RES 0R Ohm 1% 0402; Package_Case: 0402; RoHS: Yes; Tolerance: 1%; Created By: janjuranek; Created_Date: 2023-05-15 08:47:05; Updated_Date: 2023-05-15 08:47:18; ComponentLink1Description: Datasheet; ComponentLink2Description: Supplier Part Details
R107-R110 = 30073: RES 4k7 Ohm 1% 0402; Part_Status: New; ID: 30073; Updated By: Jan; Sorted_Value: 4; Value: 4k7; Part_Type: Resistor; Manufacturer Part Description: RES 4k7 Ohm 1% 0402; Package_Case: 0402; RoHS: Yes; Temperature Range: -40 to +150C; Tolerance: 1%; Created By: Jan; Created_Date: 2023-03-02 13:15:12; Updated_Date: 2023-03-02 13:15:46; ComponentLink1Description: Datasheet; ComponentLink2Description: Supplier Part Details
R111 = 30141: RES 240R Ohm 1% 0402; Part_Status: New; ID: 30141; Updated By: janjuranek; Sorted_Value: 240; Value: 240R; Part_Type: Resistor; Manufacturer Part Description: RES 240R Ohm 1% 0402; Package_Case: 0402; RoHS: Yes; Tolerance: 1%; Created By: janjuranek; Created_Date: 2023-04-13 00:40:15; Updated_Date: 2023-04-13 00:40:34; ComponentLink1Description: Datasheet; ComponentLink2Description: Supplier Part Details
U1 = 30145: IC MPU STM32MP1 650MHZ 354LFBGA; Mfr_Name: STMicroelectronics; Part_Status: New; ID: 30145; Updated By: janjuranek; RefDes: RefDes; TYPE: IC; Value: STM32MP157CAB3; Part_Type: IC; Manufacturer Part Number: STM32MP157CAB3; Manufacturer: STMicroelectronics; Manufacturer Part Description: IC MPU STM32MP1 650MHZ 354LFBGA; Supplier 1: Digi-Key; Supplier Part Number 1: STM32MP157CAB3-ND; Package_Case: 354-LFBGA; RoHS: Yes; Temperature Range: -40C to +125C (TA); Created By: janjuranek; Created_Date: 2023-04-18 09:47:39; Updated_Date: 2023-04-18 09:49:15; ComponentLink1Description: Datasheet; ComponentLink2Description: Supplier Part Details; ComponentLink2URL: https://www.digikey.com/products/en?keywords=STM32MP157CAB3
X1 = 30166: Crystal Ceramic 24MHz; Manufacturer: Diodes Incorporated; Part_Status: New; ID: 30166; Tolerance: ±20ppm; Updated By: janjuranek; Value: FW2400080; Part_Type: Crystal; Manufacturer Part Number: FW2400080; Manufacturer Part Description: Crystal Ceramic 24MHz; Supplier 1: Digi-Key; Supplier Part Number 1: 31-FW2400080-ND; RoHS: Yes; Temperature Range: -40C to +85C; Created By: janjuranek; Created_Date: 2023-05-01 22:52:25; Updated_Date: 2023-05-02 16:29:25; ComponentLink1Description: Datasheet; ComponentLink2Description: Supplier Part Details; ComponentLink2URL: https://www.digikey.com/products/en?keywords=FW2400080

## Sheet Ethernet.SchDoc
size A3; SheetNumber: 2; SheetTotal: 14
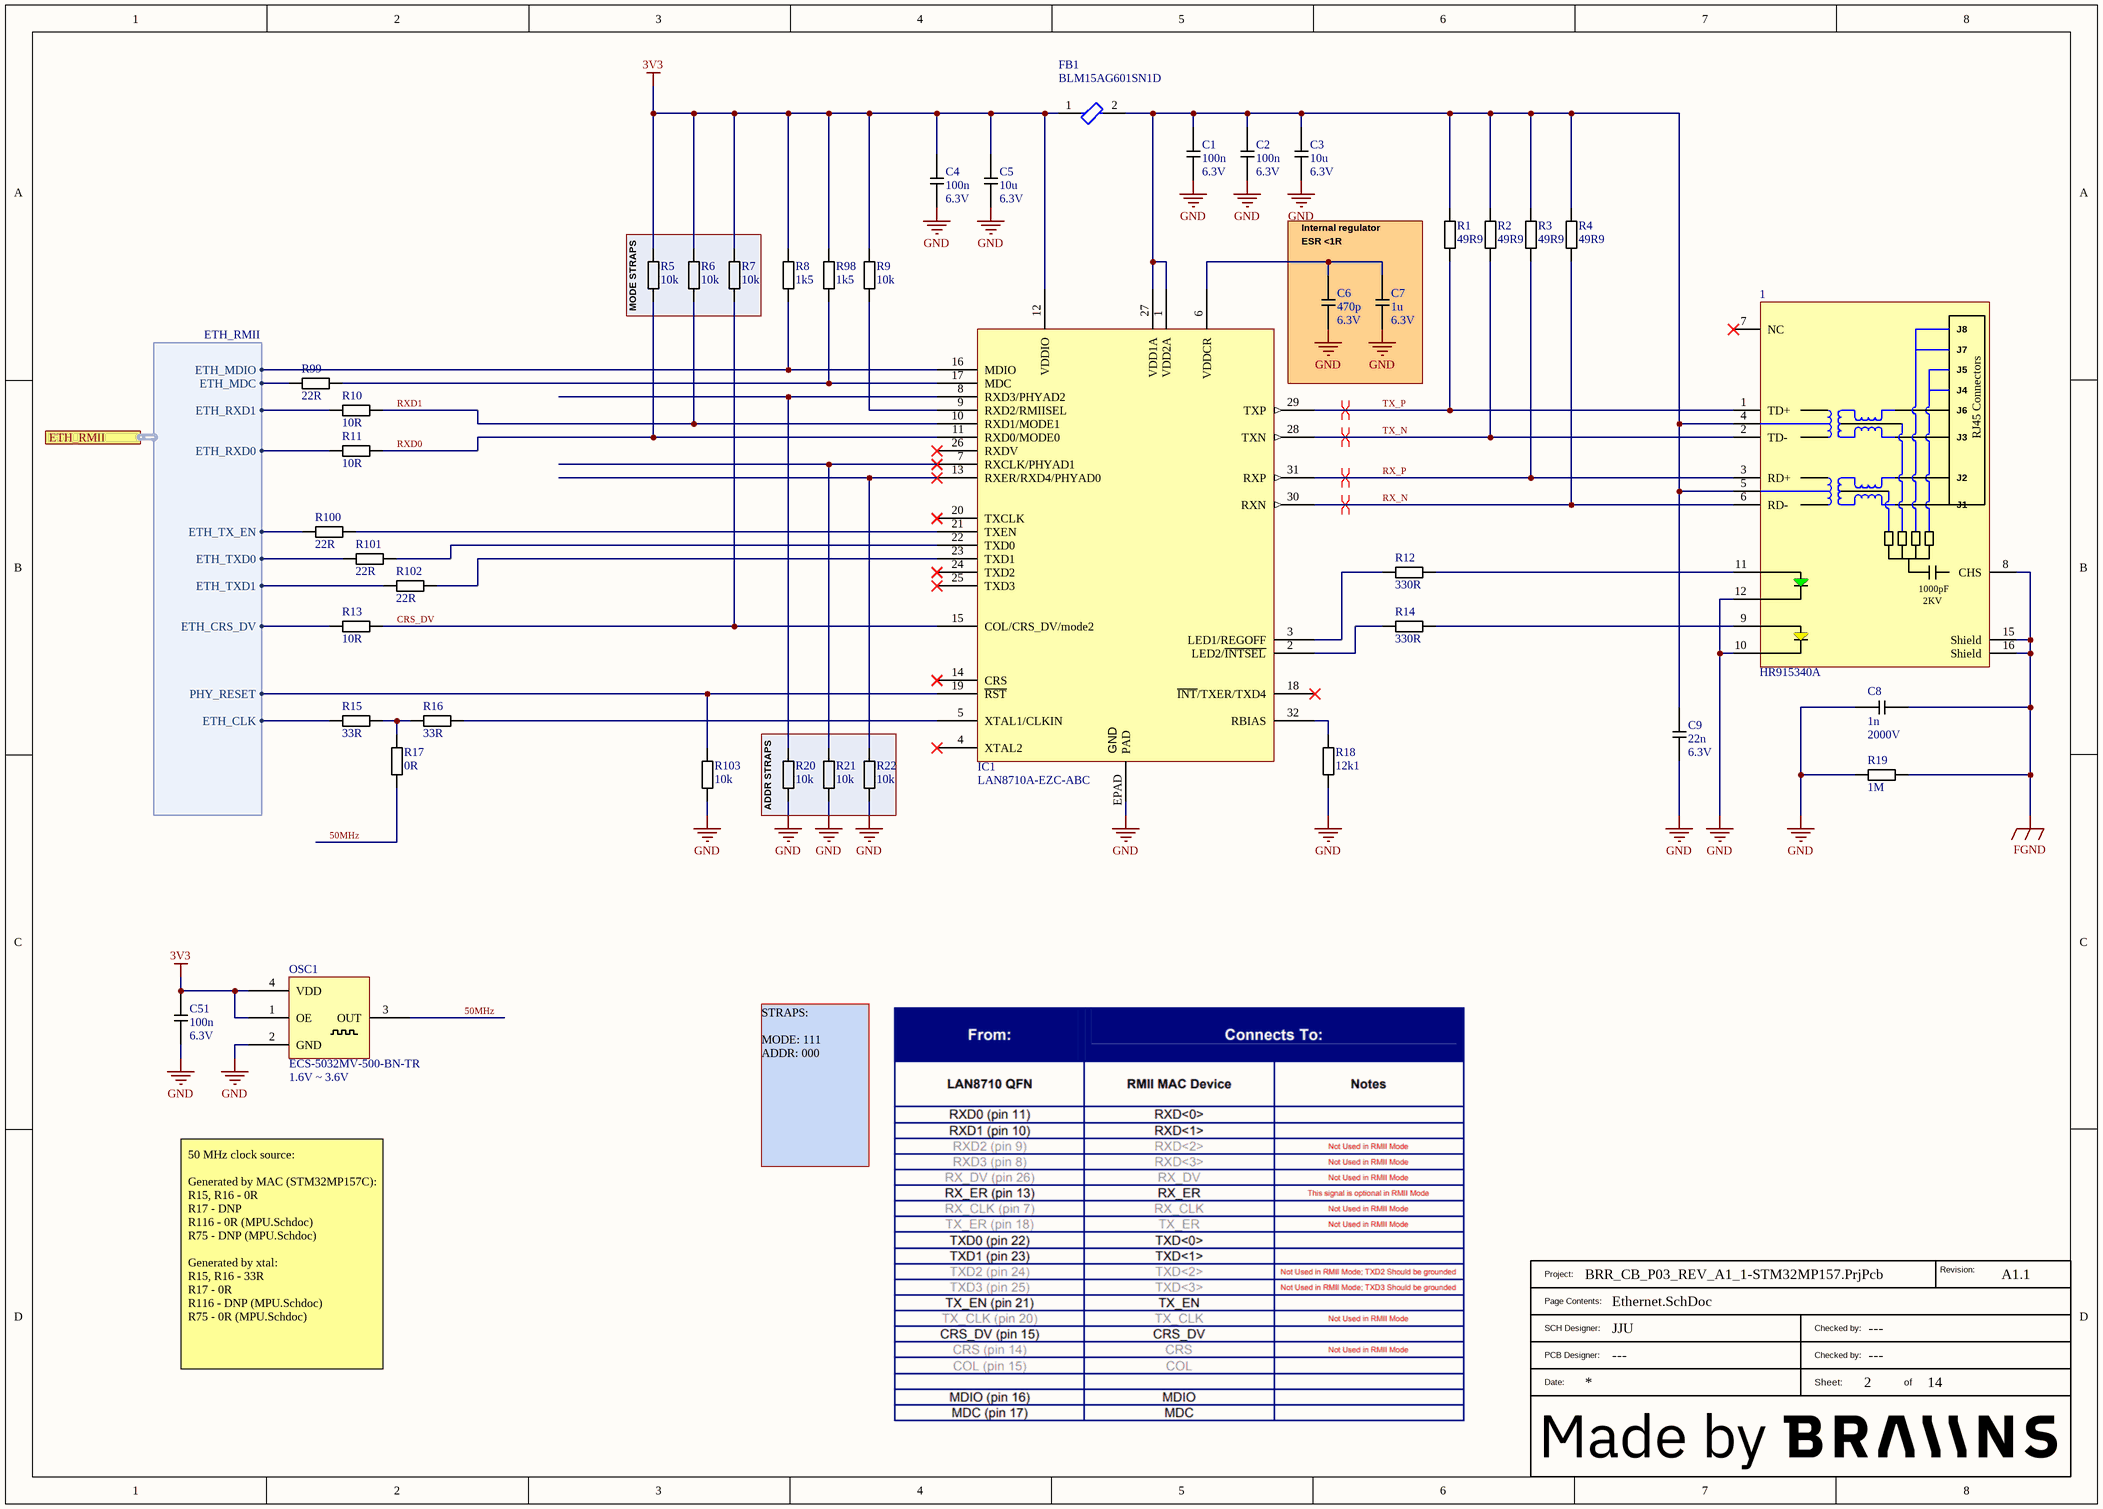
[diagram p2: Ethernet.SchDoc]

### Parts
(Parts that share a designator on the sheet are numbered #1, #2 ... from top to bottom, then left to right.)
1  HR915340A  [HR915340A]
?#3  BraiinsTitleBlockWithLogo  (value not drawn)  (graphical)
C1  Voltage_Rating: 6.3V  [CAP0402]  (hidden comment: 100n)
C2  Voltage_Rating: 6.3V  [CAP0402]  (hidden comment: 100n)
C3  Voltage_Rating: 6.3V  [CAP0805]  (hidden comment: 10u)
C4  Voltage_Rating: 6.3V  [CAP0402]  (hidden comment: 100n)
C5  Voltage_Rating: 6.3V  [CAP0805]  (hidden comment: 10u)
C6  Voltage_Rating: 6.3V  [CAP0402]  (hidden comment: 470p)
C7  Voltage_Rating: 6.3V  [CAP0402]  (hidden comment: 1u)
C8  Voltage_Rating: 2000V  [CAP1206]  (hidden comment: 1n)
C9  Voltage_Rating: 6.3V  [CAP0402]  (hidden comment: 22n)
C51  Voltage_Rating: 6.3V  [CAP0402]  (hidden comment: 100n)
FB1  BLM15AG601SN1D  [FP-BLM15-0_05-MFG]
IC1  LAN8710A-EZC-ABC  [QFN32]
OSC1  Voltage_Rating: 1.6V ~ 3.6V  [5032_CLOCK_GEN]  (hidden comment: ECS-5032MV-500-BN-TR)
R1  49R9  [RES0402]
R2  49R9  [RES0402]
R3  49R9  [RES0402]
R4  49R9  [RES0402]
R5  10k  [RES0402]
R6  10k  [RES0402]
R7  10k  [RES0402]
R8  1k5  [RES0402]
R9  10k  [RES0402]
R10  10R  [RES0402]
R11  10R  [RES0402]
R12  330R  [RES0402]
R13  10R  [RES0402]
R14  330R  [RES0402]
R15  33R  [RES0402]
R16  33R  [RES0402]
R17  0R  [RES0402]
R18  12k1  [RES0402]
R19  1M  [RES0603]
R20  10k  [RES0402]
R21  10k  [RES0402]
R22  10k  [RES0402]
R98  1k5  [RES0402]
R99  22R  [RES0402]
R100  22R  [RES0402]
R101  22R  [RES0402]
R102  22R  [RES0402]
R103  10k  [RES0402]

### Blocks framed on the sheet
MODE STRAPS: R5-R7
ADDR STRAPS: R20-R22

### Ports
ETH_RMII (harness ETH_RMII)

### Harnesses
ETH_RMII: ETH_CRS_DV, ETH_MDC, ETH_MDIO, ETH_CLK, ETH_RXD0, ETH_RXD1, ETH_TXD0, ETH_TXD1, ETH_TX_EN, PHY_RESET

### Nets
3V3: C4.1 C5.1 C51.1 FB1.1 IC1.12(VDDIO) OSC1.1(OE) OSC1.4(VDD) R5.1 R6.1 R7.1 R8.1 R9.1 R98.1
FGND: 1.8(CHS) 1.15(Shield) 1.16(Shield) C8.2 R19.2
GND: 1.10(C) 1.12(C) C1.2 C2.2 C3.2 C4.2 C5.2 C6.2 C7.2 C8.1 C9.2 C51.2 IC1.EPAD(PAD) OSC1.2(GND) R18.2 R19.1 R20.2 R21.2 R22.2 R103.2
50MHz: OSC1.3(OUT) R17.2
CRS_DV: IC1.15(COL/CRS_DV/mode2) R7.2 R13.2
ETH_CLK: R15.1 ; port ETH_RMII.ETH_CLK
ETH_CRS_DV: R13.1 ; port ETH_RMII.ETH_CRS_DV
ETH_MDC: R99.1 ; port ETH_RMII.ETH_MDC
ETH_MDIO: IC1.16(MDIO) R8.2 ; port ETH_RMII.ETH_MDIO
ETH_PHY_RESET: IC1.19(~{RST}) R103.1 ; port ETH_RMII.PHY_RESET
ETH_RXD0: R11.1 ; port ETH_RMII.ETH_RXD0
ETH_RXD1: R10.1 ; port ETH_RMII.ETH_RXD1
ETH_TX_EN: R100.1 ; port ETH_RMII.ETH_TX_EN
ETH_TXD0: R101.1 ; port ETH_RMII.ETH_TXD0
ETH_TXD1: R102.1 ; port ETH_RMII.ETH_TXD1
RX_N: 1.6(RD-) IC1.30(RXN) R4.2
RX_P: 1.3(RD+) IC1.31(RXP) R3.2
RXD0: IC1.11(RXD0/MODE0) R5.2 R11.2
RXD1: IC1.10(RXD1/MODE1) R6.2 R10.2
TX_N: 1.2(TD-) IC1.28(TXN) R2.2
TX_P: 1.1(TD+) IC1.29(TXP) R1.2
Net1_4: 1.4 1.5 C1.1 C2.1 C3.1 C9.1 FB1.2 IC1.1(VDD2A) IC1.27(VDD1A) R1.1 R2.1 R3.1 R4.1
Net1_9: 1.9(A) R14.2
Net1_11: 1.11(A) R12.2
NetC6_1: C6.1 C7.1 IC1.6(VDDCR)
NetIC1_2: IC1.2(LED2/~{INTSEL}) R14.1
NetIC1_3: IC1.3(LED1/REGOFF) R12.1
NetIC1_5: IC1.5(XTAL1/CLKIN) R16.2
NetIC1_7: IC1.7(RXCLK/PHYAD1) R21.1
NetIC1_8: IC1.8(RXD3/PHYAD2) R20.1
NetIC1_9: IC1.9(RXD2/RMIISEL) R9.2
NetIC1_13: IC1.13(RXER/RXD4/PHYAD0) R22.1
NetIC1_17: IC1.17(MDC) R98.2 R99.2
NetIC1_21: IC1.21(TXEN) R100.2
NetIC1_22: IC1.22(TXD0) R101.2
NetIC1_23: IC1.23(TXD1) R102.2
NetIC1_32: IC1.32(RBIAS) R18.1
NetR15_2: R15.2 R16.1 R17.1

Not connected (* = marked no-connect by the designer): 1 7(NC)*; IC1 4(XTAL2)* 14(CRS)* 18(~{INT}/TXER/TXD4)* 20(TXCLK)* 24(TXD2)* 25(TXD3)* 26(RXDV)*

### Layout directives
differential pair: RX_N, RX_P, TX_N, TX_P

### Notes on the sheet
- ESR <1R
- Internal regulator
- STRAPS:
  MODE: 111
  ADDR: 000
- 50 MHz clock source:
  Generated by MAC (STM32MP157C):
  R15, R16 - 0R
  R17 - DNP
  R116 - 0R (MPU.Schdoc)
  R75 - DNP (MPU.Schdoc)
  Generated by xtal:
  R15, R16 - 33R
  R17 - 0R
  R116 - DNP (MPU.Schdoc)
  R75 - 0R (MPU.Schdoc)
- (in symbol 30126) GND
- (in symbol 30130) J8; J7; J5; J4; RJ45 Connectors; J6; J3; J2; J1; 1000pF; 2KV
- (in symbol BraiinsTitleBlockWithLogo) Revision:; Project:; Page Contents:; SCH Designer:; Checked by:; PCB Designer:; Date:; Sheet:; of

### Library data of the parts
1 = 30130: 10BASE-T/100BASE-T Connector with internal magnetics; Manufacturer: HANRUN; Part_Status: New; ID: 30130; Updated By: janjuranek; Value: HR915340A; Part_Type: Connector; Manufacturer Part Number: HR915340A; Manufacturer Part Description: 10BASE-T/100BASE-T Connector with internal magnetics; Created By: janjuranek; Created_Date: 2023-03-29 08:06:37; Updated_Date: 2023-04-11 15:55:39; ComponentLink1Description: Datasheet; ComponentLink2Description: Supplier Part Details
C1 C2 C4 C51 = 30154: CAP CER 100n 10% 6.3V 0402; Part_Type: Capacitor; Part_Status: New; ID: 30154; Dielectric: X7R; Updated By: janjuranek; Sorted_Value: 100; Value: 100n; Sub_Type: CER; Manufacturer Part Description: CAP CER 100n 10% 6.3V 0402; Package_Case: 0402; RoHS: Yes; Tolerance: 10%; Created By: janjuranek; Created_Date: 2023-05-01 19:17:49; Updated_Date: 2023-05-01 19:19:14; ComponentLink1Description: Datasheet; ComponentLink2Description: Supplier Part Details
C3 C5 = 30174: CAP CER 10u 10% 6.3V X7R 0805; Part_Type: Capacitor; Part_Status: New; ID: 30174; Updated By: janjuranek; Sorted_Value: 10; Value: 10u; Sub_Type: CER; Manufacturer Part Description: CAP CER 10u 10% 6.3V X7R 0805; Package_Case: 0805; RoHS: Yes; Dielectric: X7R; Tolerance: 10%; Created By: janjuranek; Created_Date: 2023-05-09 02:18:46; Updated_Date: 2023-05-09 02:19:22; ComponentLink1Description: Datasheet; ComponentLink2Description: Supplier Part Details
C6 = 30163: CAP CER 470p 10% 6.3V X7R 0402; Part_Type: Capacitor; Part_Status: New; ID: 30163; Updated By: janjuranek; Sorted_Value: 470; Value: 470p; Sub_Type: CER; Manufacturer Part Description: CAP CER 470p 10% 6.3V X7R 0402; Package_Case: 0402; RoHS: Yes; Dielectric: X7R; Tolerance: 10%; Created By: janjuranek; Created_Date: 2023-05-01 19:44:11; Updated_Date: 2023-05-01 19:44:28; ComponentLink1Description: Datasheet; ComponentLink2Description: Supplier Part Details
C7 = 30155: CAP CER 1u 10% 6.3V X7R 0402; Part_Type: Capacitor; Part_Status: New; ID: 30155; Updated By: janjuranek; Sorted_Value: 1; Value: 1u; Sub_Type: CER; Manufacturer Part Description: CAP CER 1u 10% 6.3V X7R 0402; Package_Case: 0402; RoHS: Yes; Tolerance: 10%; Created By: janjuranek; Created_Date: 2023-05-01 19:24:23; Updated_Date: 2023-05-01 19:25:09; ComponentLink1Description: Datasheet; ComponentLink2Description: Supplier Part Details; Dielectric: X7R
C8 = 30107: CAP CER 1n 5% 2000V 1206; Part_Type: Capacitor; Part_Status: New; ID: 30107; Updated By: janjuranek; Sorted_Value: 1; Value: 1n; Sub_Type: CER; Manufacturer Part Description: CAP CER 1n 5% 2000V 1206; Package_Case: 1206; RoHS: Yes; Tolerance: 5%; Created By: janjuranek; Created_Date: 2023-03-14 13:31:22; Updated_Date: 2023-03-14 13:32:03; ComponentLink1Description: Datasheet; ComponentLink2Description: Supplier Part Details
C9 = 30161: CAP CER 22n 10% 6.3V X7R 0402; Part_Type: Capacitor; Part_Status: New; ID: 30161; Updated By: janjuranek; Sorted_Value: 22; Value: 22n; Sub_Type: CER; Manufacturer Part Description: CAP CER 22n 10% 6.3V X7R 0402; Package_Case: 0402; RoHS: Yes; Tolerance: 10%; Created By: janjuranek; Created_Date: 2023-05-01 19:41:33; Updated_Date: 2023-05-01 19:42:04; ComponentLink1Description: Datasheet; ComponentLink2Description: Supplier Part Details; Dielectric: X7R
FB1 = CMP-0686-00187-4: Chip Ferrite Bead, 0402, 600Ω @ 100MHz, 0.52Ω, 25%, 300mA; DC Resistance-Max: 600mR; Number of Lines: 1; DC Resistance (DCR): 520mR; Shielding: Unshielded; Impedance: 600R; Material: Steel; Frequency: 100MHz; Lead Free: Lead Free; Max DC Current: 300mA; Test Frequency: 100MHz; Depth: 0.55mm; Length: 1mm; Case Code (Imperial): 0402; Packaging: Tape and Reel; Height: 0.5mm; Max Operating Temperature: 125°C; Military Standard: Not; REACH SVHC: No SVHC; Case Code (Metric): 1005; Series: BLM15AG_SN; Core Material: Ferrite; Termination: SMD/SMT; DC Current: 300mA; Package Quantity: 10000; Width: 0.5mm; RoHS Compliant: Yes; Min Operating Temperature: -55°C; Current Rating: 300mA; Case/Package: 0402; Number of Pins: 2; Radiation Hardening: No; Tolerance: 25%; Number of Circuits: 1; Max Current Rating: 300mA
IC1 = 30126: 10BASE-T/100BASE-TX PHY; Part_Type: IC; Manufacturer: Microchip; Part_Status: New; ID: 30126; Updated By: janjuranek; Notes: Missing 3D model.; Value: LAN8710A-EZC-ABC; Manufacturer Part Number: LAN8710A-EZC-ABC; Manufacturer Part Description: 10BASE-T/100BASE-TX PHY; RoHS: Yes; Created By: janjuranek; Created_Date: 2023-03-28 20:05:49; Updated_Date: 2023-04-06 10:16:27; ComponentLink1Description: Datasheet; ComponentLink2Description: Supplier Part Details
OSC1 = 30144: XTAL OSC 50MHZ HCMOS SMD; Manufacturer: ECS Inc.; Part_Status: New; ID: 30144; Current_Rating: 8mA; Updated By: janjuranek; Value: ECS-5032MV-500-BN-TR; Part_Type: XTAL; Manufacturer Part Number: ECS-5032MV-500-BN-TR; Manufacturer Part Description: XTAL OSC 50MHZ HCMOS SMD; Supplier 1: Digi-Key; Supplier Part Number 1: 50-ECS-5032MV-500-BN-TR-ND; RoHS: Yes; Temperature Range: -40C to +85C; Created By: janjuranek; Created_Date: 2023-04-16 22:19:10; Updated_Date: 2023-04-16 22:19:46; ComponentLink1Description: Datasheet; ComponentLink2Description: Supplier Part Details; ComponentLink2URL: https://www.digikey.com/products/en?keywords=ECS-5032MV-500-BN-TR
R1-R4 = 30160: RES 49R9 Ohm 1% 0402; Part_Status: New; ID: 30160; Updated By: janjuranek; Sorted_Value: 49; Value: 49R9; Part_Type: Resistor; Manufacturer Part Description: RES 49R9 Ohm 1% 0402; Package_Case: 0402; RoHS: Yes; Tolerance: 1%; Created By: janjuranek; Created_Date: 2023-05-01 19:40:18; Updated_Date: 2023-05-01 19:40:31; ComponentLink1Description: Datasheet; ComponentLink2Description: Supplier Part Details
R5-R7 R20-R22 R103 = 30071: RES 10k Ohm 1% 0402; Part_Status: New; ID: 30071; Updated By: Jan; Sorted_Value: 10000; Value: 10k; Part_Type: Resistor; Manufacturer Part Description: RES 10k Ohm 1% 0402; Package_Case: 0402; RoHS: Yes; Tolerance: 1%; Created By: Jan; Created_Date: 2023-03-02 13:13:56; Updated_Date: 2023-03-02 13:14:31; ComponentLink1Description: Datasheet; ComponentLink2Description: Supplier Part Details; Temperature Range: -40 to +150C
R8 R98 = 30158: RES 1k5 Ohm 1% 0402; Part_Status: New; ID: 30158; Updated By: janjuranek; Sorted_Value: 1; Value: 1k5; Part_Type: Resistor; Manufacturer Part Description: RES 1k5 Ohm 1% 0402; Package_Case: 0402; RoHS: Yes; Tolerance: 1%; Created By: janjuranek; Created_Date: 2023-05-01 19:36:30; Updated_Date: 2023-05-01 19:36:42; ComponentLink1Description: Datasheet; ComponentLink2Description: Supplier Part Details
R9 = 30071: RES 10k Ohm 1% 0402; Part_Status: New; ID: 30071; Updated By: janjuranek; Sorted_Value: 10000; Value: 10k; Part_Type: Resistor; Manufacturer Part Description: RES 10k Ohm 1% 0402; Package_Case: 0402; RoHS: Yes; Tolerance: 1%; Created By: Jan; Created_Date: 2023-03-02 13:13:56; Updated_Date: 2023-05-01 19:36:28; ComponentLink1Description: Datasheet; ComponentLink2Description: Supplier Part Details; Temperature Range: -40 to +150C
R10 R11 R13 = 30162: RES 10R Ohm 1% 0402; Part_Status: New; ID: 30162; Updated By: janjuranek; Sorted_Value: 10; Value: 10R; Part_Type: Resistor; Manufacturer Part Description: RES 10R Ohm 1% 0402; Package_Case: 0402; RoHS: Yes; Tolerance: 1%; Created By: janjuranek; Created_Date: 2023-05-01 19:42:43; Updated_Date: 2023-05-01 19:42:58; ComponentLink1Description: Datasheet; ComponentLink2Description: Supplier Part Details
R12 R14 = 30083: RES 330R Ohm 1% 0402; Part_Status: New; ID: 30083; Updated By: Jan; Sorted_Value: 330; Value: 330R; Part_Type: Resistor; Manufacturer Part Description: RES 330R Ohm 1% 0402; Package_Case: 0402; RoHS: Yes; Tolerance: 1%; Created By: Jan; Created_Date: 2023-03-02 15:51:16; Updated_Date: 2023-03-02 15:51:32; ComponentLink1Description: Datasheet; ComponentLink2Description: Supplier Part Details
R15 R16 = 30088: RES 33R Ohm 1% 0402; Part_Status: New; ID: 30088; Updated By: jju; Sorted_Value: 33; Value: 33R; Part_Type: Resistor; Manufacturer Part Description: RES 33R Ohm 1% 0402; Package_Case: 0402; RoHS: Yes; Tolerance: 1%; Created By: jju; Created_Date: 2023-03-06 16:34:08; Updated_Date: 2023-03-06 16:34:37; ComponentLink1Description: Datasheet; ComponentLink2Description: Supplier Part Details
R17 = 30178: as R75 on sheet MPU; Value: 0R; Part_Type: Resistor; Manufacturer Part Description: RES 0R Ohm 1% 0402; Package_Case: 0402; RoHS: Yes; Tolerance: 1%; Created By: janjuranek; Created_Date: 2023-05-15 08:47:05; Updated_Date: 2023-05-15 08:47:18; ComponentLink1Description: Datasheet; ComponentLink2Description: Supplier Part Details
R18 = 30159: RES 12k1 Ohm 1% 0402; Part_Status: New; ID: 30159; Updated By: janjuranek; Sorted_Value: 12; Value: 12k1; Part_Type: Resistor; Manufacturer Part Description: RES 12k1 Ohm 1% 0402; Package_Case: 0402; RoHS: Yes; Tolerance: 1%; Created By: janjuranek; Created_Date: 2023-05-01 19:38:53; Updated_Date: 2023-05-01 19:39:06; ComponentLink1Description: Datasheet; ComponentLink2Description: Supplier Part Details
R19 = 30054: RES 1M Ohm 0,01 0603 (1608 Metric); Manufacturer Part Number: Generic resistor 1M; Part_Status: New; ID: 30054; Tolerance: 0,01; Updated By: Jan; Sorted_Value: 1000000; Value: 1M; Part_Type: Resistor; Manufacturer Part Description: RES 1M Ohm 0,01 0603 (1608 Metric); Package_Case: 0603; Created By: Jan; Created_Date: 2023-03-01 20:43:33; Updated_Date: 2023-03-01 21:23:54; ComponentLink1Description: Datasheet; ComponentLink2Description: Supplier Part Details
R99-R102 = 30156: RES 22R Ohm 1% 0402; Part_Status: New; ID: 30156; Updated By: janjuranek; Sorted_Value: 22; Value: 22R; Part_Type: Resistor; Manufacturer Part Description: RES 22R Ohm 1% 0402; Package_Case: 0402; RoHS: Yes; Tolerance: 1%; Created By: janjuranek; Created_Date: 2023-05-01 19:29:39; Updated_Date: 2023-05-01 19:30:05; ComponentLink1Description: Datasheet; ComponentLink2Description: Supplier Part Details

## Sheet Fan.SchDoc
size A4; SheetNumber: 4; SheetTotal: 14
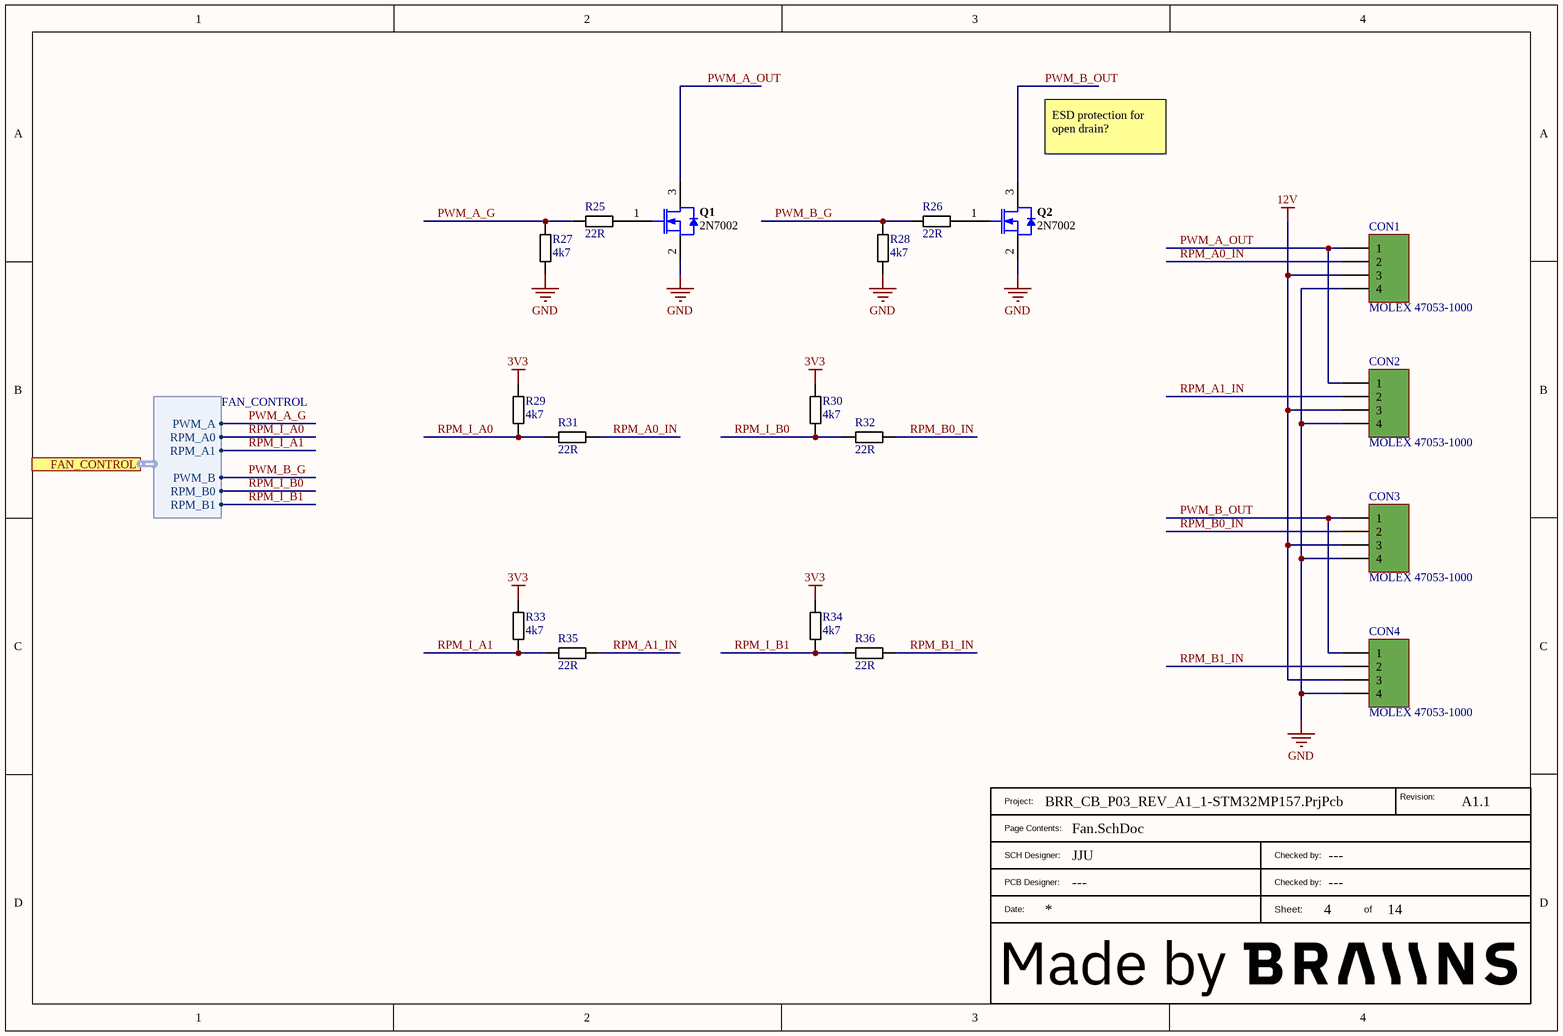
[diagram p3: Fan.SchDoc]

### Parts
(Parts that share a designator on the sheet are numbered #1, #2 ... from top to bottom, then left to right.)
?#4  BraiinsTitleBlockWithLogo  (value not drawn)  (graphical)
CON1  MOLEX 47053-1000  [MOLEX_47053-1000_BIGPADS]
CON2  MOLEX 47053-1000  [MOLEX_47053-1000_BIGPADS]
CON3  MOLEX 47053-1000  [MOLEX_47053-1000_BIGPADS]
CON4  MOLEX 47053-1000  [MOLEX_47053-1000_BIGPADS]
Q1  2N7002  [INF-PG-SOT23_M]
Q2  2N7002  [INF-PG-SOT23_M]
R25  22R  [RES0402]
R26  22R  [RES0402]
R27  4k7  [RES0402]
R28  4k7  [RES0402]
R29  4k7  [RES0402]
R30  4k7  [RES0402]
R31  22R  [RES0402]
R32  22R  [RES0402]
R33  4k7  [RES0402]
R34  4k7  [RES0402]
R35  22R  [RES0402]
R36  22R  [RES0402]

### Ports
FAN_CONTROL (harness FAN_CONTROL)

### Harnesses
FAN_CONTROL: PWM_A, PWM_B, RPM_A0, RPM_A1, RPM_B0, RPM_B1

### Nets
3V3: R29.1 R30.1 R33.1 R34.1
12V: CON1.3 CON2.3 CON3.3 CON4.3
GND: CON1.4 CON2.4 CON3.4 CON4.4 Q1.2(SOURCE) Q2.2(SOURCE) R27.2 R28.2
PWM_A_G: R25.1 R27.1 ; port FAN_CONTROL.PWM_A  [project net PWM_A]
PWM_A_OUT: CON1.1 CON2.1 Q1.3(DRAIN)
PWM_B_G: R26.1 R28.1 ; port FAN_CONTROL.PWM_B  [project net PWM_B]
PWM_B_OUT: CON3.1 CON4.1 Q2.3(DRAIN)
RPM_A0_IN: CON1.2 R31.2
RPM_A1_IN: CON2.2 R35.2
RPM_B0_IN: CON3.2 R32.2
RPM_B1_IN: CON4.2 R36.2
RPM_I_A0: R29.2 R31.1 ; port FAN_CONTROL.RPM_A0  [project net RPM_A0]
RPM_I_A1: R33.2 R35.1 ; port FAN_CONTROL.RPM_A1  [project net RPM_A1]
RPM_I_B0: R30.2 R32.1 ; port FAN_CONTROL.RPM_B0  [project net RPM_B0]
RPM_I_B1: R34.2 R36.1 ; port FAN_CONTROL.RPM_B1  [project net RPM_B1]
NetQ1_1: Q1.1(GATE) R25.2
NetQ2_1: Q2.1(GATE) R26.2

### Notes on the sheet
- ESD protection for open drain?
- (in symbol BraiinsTitleBlockWithLogo) Revision:; Project:; Page Contents:; SCH Designer:; Checked by:; PCB Designer:; Date:; Sheet:; of

### Library data of the parts
CON1-CON4 = 30102: MOLEX KK254 4pin with LOCK, MALE; Part_Type: Connector; Part_Status: New; ID: 30102; Updated By: janjuranek; Value: MOLEX 47053-1000; Manufacturer Part Number: MOLEX_47053-1000; Manufacturer: Molex; Manufacturer Part Description: MOLEX KK254 4pin with LOCK, MALE; RoHS: Yes; Created By: janjuranek; Created_Date: 2023-03-14 02:15:44; Updated_Date: 2023-07-13 14:58:10; ComponentLink1Description: Datasheet; ComponentLink2Description: Supplier Part Details
Q1 Q2 = CMP-1149-00026-1: N-Channel OptiMOS Small-Signal-Transistor, 60 V VDS, 0.3 A ID, -55 to 150 degC, PG-SOT23, Reel, Green; Manufacturer: Infineon; RDS (on) (max) (@4.5V): 4,000 mOhm; VDS (max): 60 V; IDpuls (max): 1.2Â A; QG: 0.4Â nC; RDS (on) (max): 3,000 mOhm; RthJA (max): 250 K/W; ID (max): 0.3Â A; VGS(th) (max): 2.5Â V; VGS(th) (min): 1.5Â V; Green: TRUE; Ptot (max): 0.5Â W; PackageDescription: 3-Pin Small Outline Transistor Package, 2.9 x 1.3 mm Body, 0.95 mm Pitch; Halogen-free: TRUE; ComponentLink2Description: Datasheet; ComponentLink1URL: http://www.infineon.com/; Packing: Reel; DatasheetVersion: Rev. 2.4; PartNumber: 2N7002; PackageReference: PG-SOT23; PackageVersion: Apr-08; ComponentLink3URL: http://www.infineon.com/dgdl/SOT23-Package_Overview.pdf?folderId=db3a30431936bc4b0119532290053c66&fileId=db3a30431936bc4b0119533468123c85; ComponentLink1Description: Manufacturer URL; Mounting Technology: Surface Mount; ComponentLink3Description: Package Specification; ComponentLink2URL: http://www.infineon.com/dgdl/2N7002_Rev2.4.pdf?folderId=db3a3043156fd573011622e10b5c1f67&fileId=db3a304319bc939a0119c2a9461e79e6
R25 R26 R31 R32 R35 R36 = 30156: as R99 on sheet Ethernet; Value: 22R; Part_Type: Resistor; Manufacturer Part Description: RES 22R Ohm 1% 0402; Package_Case: 0402; RoHS: Yes; Tolerance: 1%; Created By: janjuranek; Created_Date: 2023-05-01 19:29:39; Updated_Date: 2023-05-01 19:30:05; ComponentLink1Description: Datasheet; ComponentLink2Description: Supplier Part Details
R27-R30 R33 R34 = 30073: as R107 on sheet MPU; Value: 4k7; Part_Type: Resistor; Manufacturer Part Description: RES 4k7 Ohm 1% 0402; Package_Case: 0402; RoHS: Yes; Tolerance: 1%; Created By: Jan; Created_Date: 2023-03-02 13:15:12; Updated_Date: 2023-03-02 13:15:46; ComponentLink1Description: Datasheet; ComponentLink2Description: Supplier Part Details; Temperature Range: -40 to +150C